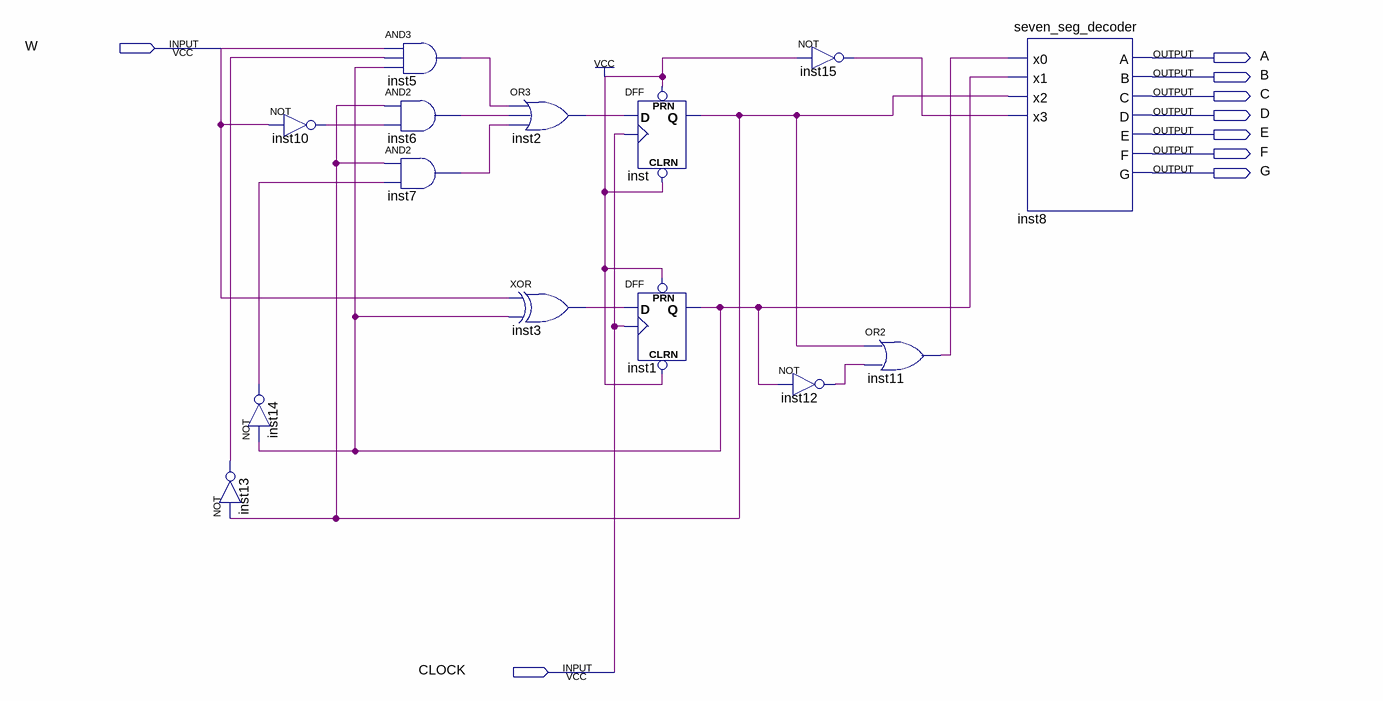
[diagram p0: schematic sheet]
// Quartus schematic lab11step2.bdf as structural Verilog: 14 symbols, 9 pins
module lab11step2 (
  input  W,
  input  CLOCK,
  output A,
  output B,
  output C,
  output D,
  output E,
  output F,
  output G
);

  wire inst1_q, inst2_out, inst3_out, inst5_out, inst6_out, inst7_out, inst10_out, inst11_out, inst12_out,
       inst13_out, inst14_out, inst15_out, inst_q;

  not inst10 (inst10_out, W);
  not inst14 (inst14_out, inst1_q);
  not inst13 (inst13_out, inst_q);
  and inst5 (inst5_out, W, inst13_out, inst1_q);
  and inst6 (inst6_out, inst_q, inst10_out);
  and inst7 (inst7_out, inst_q, inst14_out);
  or inst2 (inst2_out, inst5_out, inst6_out, inst7_out);
  xor inst3 (inst3_out, W, inst1_q);
  DFF inst (.CLRN(1'b1), .CLK(CLOCK), .D(inst2_out), .PRN(1'b1), .Q(inst_q));
  DFF inst1 (.CLRN(1'b1), .CLK(CLOCK), .D(inst3_out), .PRN(1'b1), .Q(inst1_q));
  not inst15 (inst15_out, 1'b1);
  not inst12 (inst12_out, inst1_q);
  or inst11 (inst11_out, inst_q, inst12_out);
  seven_seg_decoder inst8 (
    .x0(inst11_out), .x1(inst1_q), .x2(inst_q), .x3(inst15_out), .A(A), .B(B), .C(C), .D(D), .E(E), .F(F),
    .G(G));
endmodule
